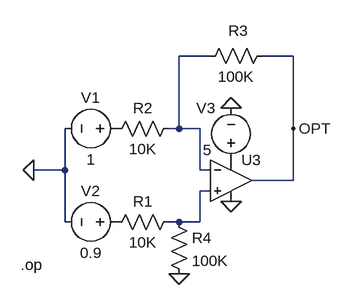
[diagram p0: schematic diffAmp.asc]
diffAmp.asc, the LTspice schematic file:
Version 4
SHEET 1 880 680
WIRE 176 -48 128 -48
WIRE 304 -48 256 -48
WIRE 128 64 128 -48
WIRE 128 64 112 64
WIRE 160 64 128 64
WIRE 304 64 304 -48
WIRE -48 128 -48 64
WIRE -48 128 -96 128
WIRE 160 128 160 64
WIRE 176 128 160 128
WIRE 304 144 304 64
WIRE 304 144 240 144
WIRE 176 160 160 160
WIRE -48 208 -48 128
WIRE 128 208 112 208
WIRE 160 208 160 160
WIRE 160 208 128 208
FLAG -96 128 0
FLAG 208 32 0
FLAG 208 176 0
FLAG 304 64 OPT
FLAG 128 288 0
SYMBOL voltage 48 64 R90
WINDOW 0 -32 56 VBottom 2
WINDOW 3 32 56 VTop 2
WINDOW 123 0 0 Left 0
WINDOW 39 0 0 Left 0
SYMATTR InstName V1
SYMATTR Value 1
SYMBOL voltage 48 208 R90
WINDOW 0 -32 56 VBottom 2
WINDOW 3 32 56 VTop 2
WINDOW 123 0 0 Left 0
WINDOW 39 0 0 Left 0
SYMATTR InstName V2
SYMATTR Value 0.9
SYMBOL res 128 192 R90
WINDOW 0 0 56 VBottom 2
WINDOW 3 32 56 VTop 2
SYMATTR InstName R1
SYMATTR Value 10K
SYMBOL res 128 48 R90
WINDOW 0 0 56 VBottom 2
WINDOW 3 32 56 VTop 2
SYMATTR InstName R2
SYMATTR Value 10K
SYMBOL voltage 208 128 R180
WINDOW 0 24 96 Left 2
WINDOW 3 30 31 Left 2
WINDOW 123 0 0 Left 0
WINDOW 39 0 0 Left 0
SYMATTR InstName V3
SYMATTR Value 5
SYMBOL res 272 -64 R90
WINDOW 0 -7 53 VBottom 2
WINDOW 3 32 56 VTop 2
SYMATTR InstName R3
SYMATTR Value 100K
SYMBOL res 112 192 R0
SYMATTR InstName R4
SYMATTR Value 100K
SYMBOL OpAmps\\UniversalOpamp2 208 144 R0
SYMATTR InstName U3
TEXT -116 274 Left 2 !.op

The netlist it stands for:
* diffAmp.asc
V1 P001 0 1
V2 P002 0 0.9
R1 N002 P002 10K
R2 N001 P001 10K
V3 P003 0 5
R3 OPT N001 100K
R4 N002 0 100K
XU3 N002 N001 P003 0 OPT level.2 Avol=1Meg GBW=10Meg Slew=10Meg ilimit=25m rail=0 Vos=0 phimargin=45 en=0 enk=0 in=0 ink=0 Rin=500Meg  ; pins IN+ IN- V+ V- OUT
.op
.lib UniversalOpamps2.sub
.backanno
.end